# Altium schematic sheet ads1299.SchDoc
size A4; SheetNumber: 4; SheetTotal: 6
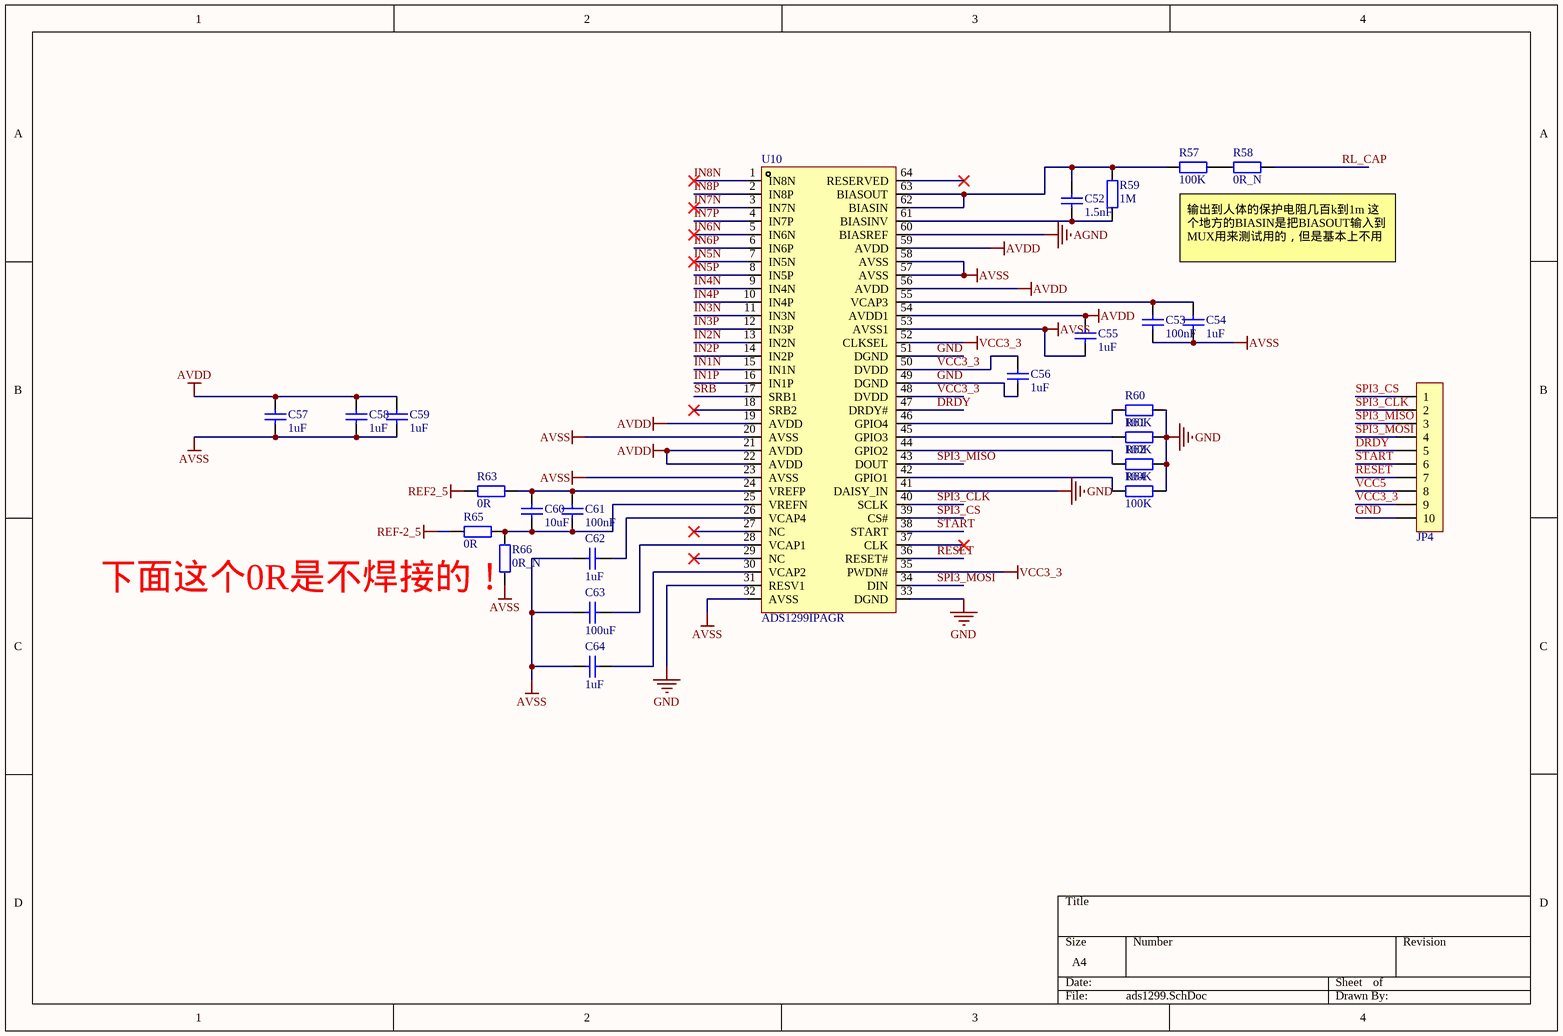
[diagram p0: ads1299.SchDoc]

## Parts
C52  1.5nF  [C0603_L]
C53  100nF  [C0603_L]
C54  1uF  [C0603_L]
C55  1uF  [C0603_L]
C56  1uF  [C0603_L]
C57  1uF  [C0603_L]
C58  1uF  [C0603_L]
C59  1uF  [C0603_L]
C60  10uF  [C0603_L]
C61  100nF  [C0603_L]
C62  1uF  [C0603_L]
C63  100uF  [C1206_L]
C64  1uF  [C0603_L]
JP4  HDR-1X10  [HDR2.54-LI-10P]  (value not drawn)
R57  100K  [R0603_L]
R58  0R_N  [R0603_L]
R59  1M  [R0603_L]
R60  100K  [R0603_L]
R61  100K  [R0603_L]
R62  100K  [R0603_L]
R63  0R  [R0603_L]
R64  100K  [R0603_L]
R65  0R  [R0603_L]
R66  0R_N  [R0603_L]
U10  ADS1299IPAGR  [TQFP64_N]

## Nets
AGND: U10.60(BIASREF)
AVDD: C55.2 C57.2 C58.2 C59.2 U10.19(AVDD) U10.21(AVDD) U10.22(AVDD) U10.54(AVDD1) U10.56(AVDD) U10.59(AVDD)
AVSS: C53.1 C54.1 C55.1 C57.1 C58.1 C59.1 C62.1 C63.2 C64.1 R66.2 U10.20(AVSS) U10.23(AVSS) U10.32(AVSS) U10.53(AVSS1) U10.57(AVSS) U10.58(AVSS)
GND: C56.1 JP4.10 R60.2 R61.2 R62.2 R64.2 U10.31(RESV1) U10.33(DGND) U10.41(DAISY_IN) U10.49(DGND) U10.51(DGND)
REF2_5: R63.2
REF-2_5: R65.2
VCC3_3: C56.2 JP4.9 U10.35(PWDN#) U10.48(DVDD) U10.50(DVDD) U10.52(CLKSEL)
DRDY: JP4.5 U10.47(DRDY#)
IN1N: U10.15(IN1N)
IN1P: U10.16(IN1P)
IN2N: U10.13(IN2N)
IN2P: U10.14(IN2P)
IN3N: U10.11(IN3N)
IN3P: U10.12(IN3P)
IN4N: U10.9(IN4N)
IN4P: U10.10(IN4P)
IN5N: U10.7(IN5N)
IN5P: U10.8(IN5P)
IN6N: U10.5(IN6N)
IN6P: U10.6(IN6P)
IN7N: U10.3(IN7N)
IN7P: U10.4(IN7P)
IN8N: U10.1(IN8N)
IN8P: U10.2(IN8P)
RESET: JP4.7 U10.36(RESET#)
RL_CAP: R58.1
SPI3_CLK: JP4.2 U10.40(SCLK)
SPI3_CS: JP4.1 U10.39(CS#)
SPI3_MISO: JP4.3 U10.43(DOUT)
SPI3_MOSI: JP4.4 U10.34(DIN)
SRB: U10.17(SRB1)
START: JP4.6 U10.38(START)
VCC5: JP4.8
NetC52_1: C52.1 R59.2 U10.61(BIASINV)
NetC52_2: C52.2 R57.1 R59.1 U10.62(BIASIN) U10.63(BIASOUT)
NetC53_2: C53.2 C54.2 U10.55(VCAP3)
NetC60_1: C60.1 C61.1 R65.1 R66.1 U10.25(VREFN)
NetC60_2: C60.2 C61.2 R63.1 U10.24(VREFP)
NetC62_2: C62.2 U10.26(VCAP4)
NetC63_1: C63.1 U10.28(VCAP1)
NetC64_2: C64.2 U10.30(VCAP2)
NetR57_2: R57.2 R58.2
NetR60_1: R60.1 U10.46(GPIO4)
NetR61_1: R61.1 U10.45(GPIO3)
NetR62_1: R62.1 U10.44(GPIO2)
NetR64_1: R64.1 U10.42(GPIO1)

Not connected (* = marked no-connect by the designer): U10 18(SRB2)* 27(NC)* 29(NC)* 37(CLK)* 64(RESERVED)*

## Notes on the sheet
- 输出到人体的保护电阻几百k到1m 这个地方的BIASIN是把BIASOUT输入到MUX用来测试用的，但是基本上不用
- 下面这个0R是不焊接的！

## Library data of the parts
C52-C64 = C: 贴片电容/MLCC电容; BOM名称: 无极性贴片电容; 联系下单店铺卖家 免费帮你查找封装: 联系下单店铺卖家 免费技术指导
  C63: jlc_id: C7432784
JP4 = Header 10: 10P接插件; 联系卖家，免费查找封装: 唯一出售店铺网址https://shop463601444.taobao.com; 封装库来自淘宝卖家ID：黄晶宝石: 其他店铺购入均为盗版封装库，请立即申请退款，本店现金奖励50~200元; BOM名称: 10P接插件
R57-R66 = R: 贴片电阻; 联系下单店铺卖家 免费帮你查找封装: 联系下单店铺卖家 免费技术指导; BOM名称: 贴片电阻
U10 = ADS1299IPAGR: 24位、多通道EEG/ECG ADC，内置增益放大; Manufacturer: TI(德州仪器); Add into BOM: yes; Supply Voltage: 5V；1.8V~3.6V; Symbol: ADS1299IPAGR; Device: ADS1299IPAGR; LCSC Part Name: ADS1299-x 低噪声、4/6/8通道、24bit 、同时采样模数转换器，用于EEG和生物电bit 测量; Supplier Part: C476817; Manufacturer Part: ADS1299IPAGR; Supplier Footprint: TQFP-64(10x10); JLCPCB Part Class: 扩展库; Datasheet: https://www.ti.com/cn/lit/gpn/ads1299; Supplier: LCSC; Convert to PCB: yes; jlc_id: C476817